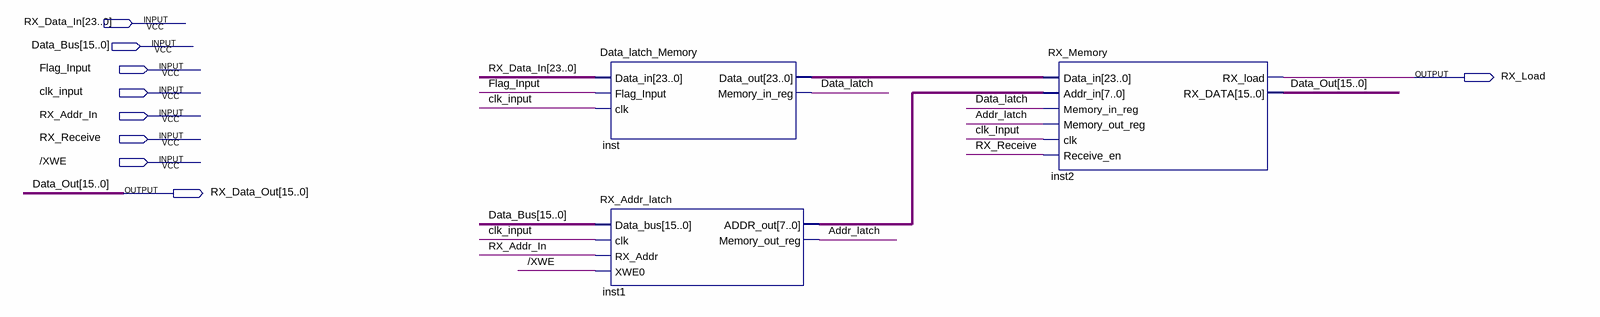
[diagram p0: schematic sheet]
// Quartus schematic RX_Memory_Module.bdf as structural Verilog: 3 symbols, 9 pins
module RX_Memory_Module (
  input  [23:0] RX_Data_In,
  input  [15:0] Data_Bus,
  input  Flag_Input,
  input  clk_input,
  input  RX_Addr_In,
  input  RX_Receive,
  input  \/XWE ,
  output RX_Load,
  output [15:0] RX_Data_Out
);

  wire Addr_latch, Data_latch;
  wire [7:0] inst1_addr_out;
  wire [23:0] inst_data_out;

  Data_latch_Memory inst (
    .Data_in(RX_Data_In), .Flag_Input(Flag_Input), .clk(clk_input), .Data_out(inst_data_out),
    .Memory_in_reg(Data_latch));
  RX_Addr_latch inst1 (
    .Data_bus(Data_Bus), .clk(clk_input), .RX_Addr(RX_Addr_In), .XWE0(\/XWE ), .ADDR_out(inst1_addr_out),
    .Memory_out_reg(Addr_latch));
  RX_Memory inst2 (
    .Data_in(inst_data_out), .Addr_in(inst1_addr_out), .Memory_in_reg(Data_latch),
    .Memory_out_reg(Addr_latch), .clk(clk_input), .Receive_en(RX_Receive), .RX_load(RX_Load),
    .RX_DATA(RX_Data_Out));

  // Other names for the same wires on the sheet: Data_Out[15:0] = RX_Data_Out
endmodule
